# Altium schematic sheet WIFI.SchDoc
size A4
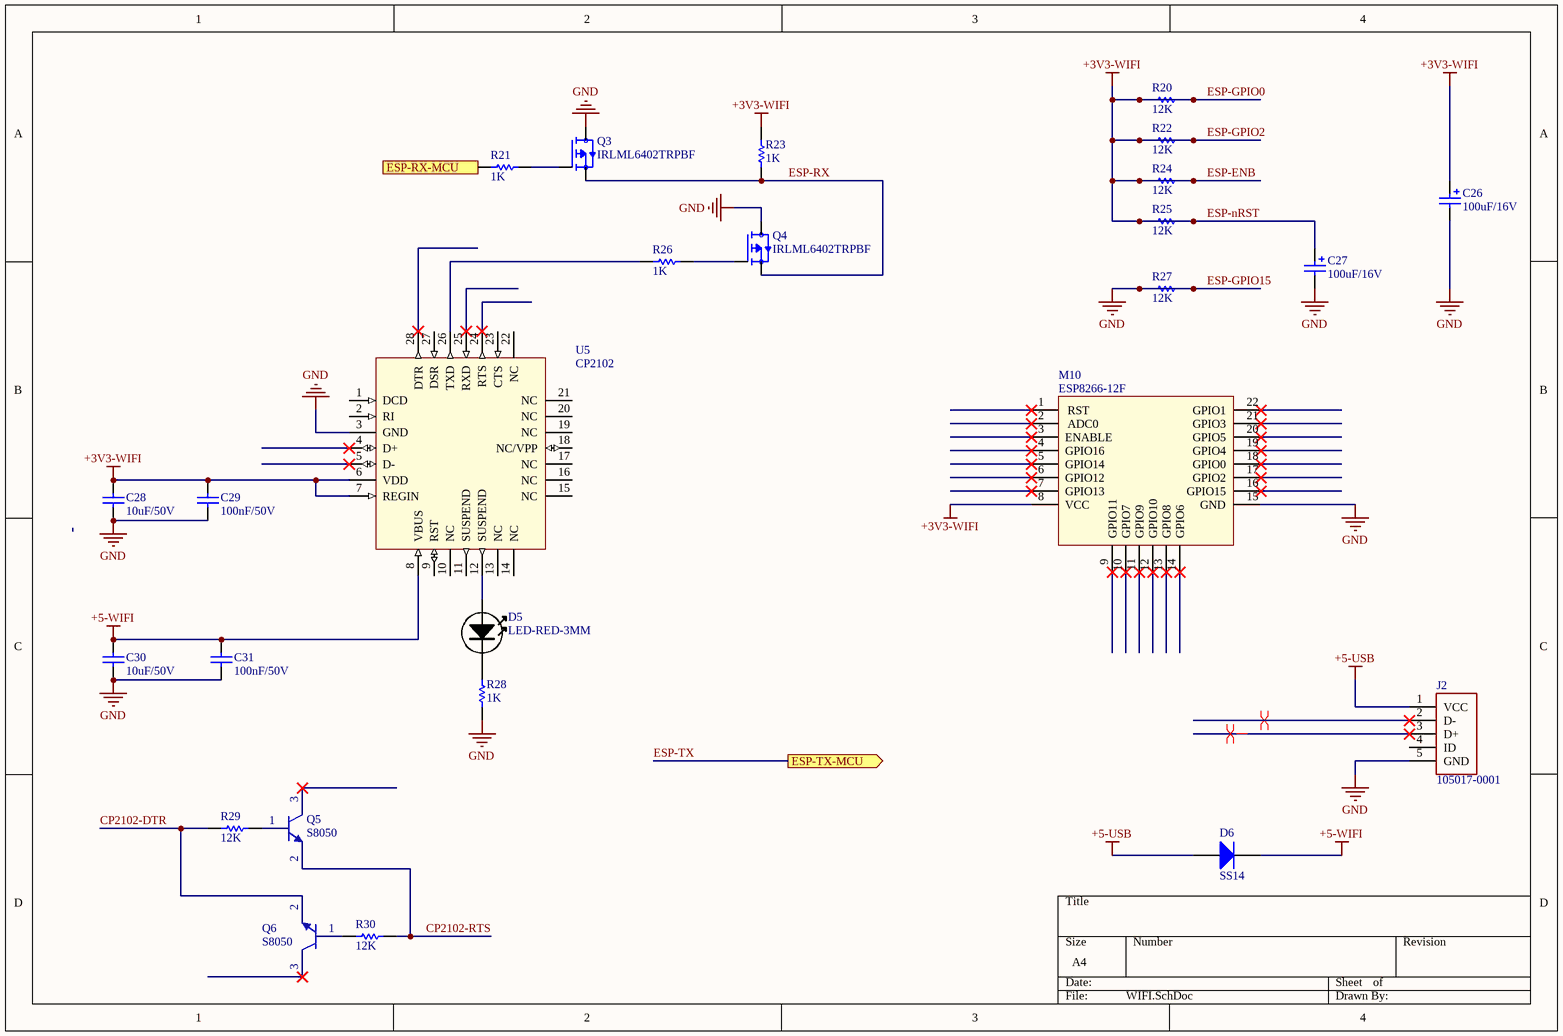
[diagram p0: WIFI.SchDoc]

## Parts
C26  value 100uF/16V  [CAP_SM_TAN]  (hidden comment: TAJB107M006RNJ)
C27  value 100uF/16V  [CAP_SM_TAN]  (hidden comment: TAJB107M006RNJ)
C28  value 10uF/50V  [CAP-SM-0805]  (hidden comment: Cap-10uF-50V-0805)
C29  value 100nF/50V  [CAP-SM-0805]  (hidden comment: Cap-100nF-50V-0805)
C30  value 10uF/50V  [CAP-SM-0805]  (hidden comment: Cap-10uF-50V-0805)
C31  value 100nF/50V  [CAP-SM-0805]  (hidden comment: Cap-100nF-50V-0805)
D5  LED-RED-3MM  [LED-3MM-RED]
D6  SS14  [SS14]
J2  105017-0001  [CONN_105017-0001]
M10  ESP8266-12F
Q3  IRLML6402TRPBF  [SOT95P237X112-3N]
Q4  IRLML6402TRPBF  [SOT95P237X112-3N]
Q5  S8050  [SOT23_NEX]
Q6  S8050  [SOT23_NEX]
R20  value 12K  [RES-SM-0805]  (hidden comment: Res-12K-0805)
R21  value 1K  [RES-SM-0805]  (hidden comment: Res-1K-0805)
R22  value 12K  [RES-SM-0805]  (hidden comment: Res-12K-0805)
R23  value 1K  [RES-SM-0805]  (hidden comment: Res-1K-0805)
R24  value 12K  [RES-SM-0805]  (hidden comment: Res-12K-0805)
R25  value 12K  [RES-SM-0805]  (hidden comment: Res-12K-0805)
R26  value 1K  [RES-SM-0805]  (hidden comment: Res-1K-0805)
R27  value 12K  [RES-SM-0805]  (hidden comment: Res-12K-0805)
R28  value 1K  [RES-SM-0805]  (hidden comment: Res-1K-0805)
R29  value 12K  [RES-SM-0805]  (hidden comment: Res-12K-0805)
R30  value 12K  [RES-SM-0805]  (hidden comment: Res-12K-0805)
U5  CP2102  [CP2102]

## Ports
ESP-RX-MCU (in), ESP-TX-MCU (out)

## Nets
+5-USB: D6.2(A) J2.1(VCC)
+5-WIFI: C30.2 C31.2 D6.1(K) U5.8(VBUS)
ESP-ENB: C26.1 C27.1 C28.2 C29.2 M10.8(VCC) R20.1 R20.2 R22.1 R22.2 R23.2 R24.1 R24.2 R25.1 R25.2 U5.6(VDD) U5.7(REGIN)  [also labelled +3V3-WIFI, ESP-GPIO0, ESP-GPIO2, ESP-nRST]
ESP-GPIO15: C26.2 C27.2 C28.1 C29.1 C30.1 C31.1 J2.5(GND) M10.15(GND) Q3.3(D) Q4.3(D) R27.1 R27.2 R28.1 U5.3(GND)  [also labelled GND]
CP2102-DTR: Q6.2(E) R29.1
CP2102-RTS: Q5.2(E) R30.2
ESP-RX: Q3.2(S) Q4.2(S) R23.1
ESP-RX-MCU: R21.1 ; port ESP-RX-MCU
ESP-TX: port ESP-TX-MCU
NetD5_A: D5.A U5.12(SUSPEND)
NetD5_K: D5.K R28.2
NetQ3_1: Q3.1(G) R21.2
NetQ4_1: Q4.1(G) R26.2
NetQ5_1: Q5.1(B) R29.2
NetQ6_1: Q6.1(B) R30.1
NetR26_1: R26.1 U5.26(TXD)

Not connected (* = marked no-connect by the designer): J2 2(D-)* 3(D+)* 4(ID); M10 1(RST)* 2(ADC0)* 3(ENABLE)* 4(GPIO16)* 5(GPIO14)* 6(GPIO12)* 7(GPIO13)* 9(GPIO11)* 10(GPIO7)* 11(GPIO9)* 12(GPIO10)* 13(GPIO8)* 14(GPIO6)* 16(GPIO15)* 17(GPIO2)* 18(GPIO0)* 19(GPIO4)* 20(GPIO5)* 21(GPIO3)* 22(GPIO1)*; Q5 3(C)*; Q6 3(C)*; U5 1(DCD) 2(RI) 4(D+)* 5(D-)* 9(RST) 10(NC) 11(SUSPEND) 13(NC) 14(NC) 15(NC) 16(NC) 17(NC) 18(NC/VPP) 19(NC) 20(NC) 21(NC) 22(NC) 23(CTS) 24(RTS)* 25(RXD)* 27(DSR) 28(DTR)*

## Layout directives
differential pair: NetJ2_2, NetJ2_3

## Library data of the parts
C26 C27 = Cap-Tan-100uF-16V: Manufacturer: Nichicon; Manufacturer Part Number: UWX1C101MCL1GB; Local Supplier: icdayroi; Local Supplier Link: https://icdayroi.com/tu-tantalum-100uf-16v-smd6032; Supplier 1: Digikey; Supplier 1 Part Number: 493-2105-1-ND; Supplier 1 Link: https://www.digikey.com/product-detail/en/nichicon/UWX1C101MCL1GB/493-2105-1-ND/590080
C28 C30 = Cap-10uF-50V-0805: CAP CER 10UF 50V X5R 0805; Manufacturer: Yageo; Manufacturer Part Number: CC0805KKX5R9BB106; Local Supplier: thegioiic; Local Supplier Link: https://thegioiic.com/products/tu-10uf-50v-0805; Supplier 1: Digikey; Supplier 1 Link: https://www.digikey.com/product-detail/en/yageo/CC0805KKX5R9BB106/311-3499-2-ND/7164383; Supplier 1 Part Number: 311-3499-2-ND
C29 C31 = Cap-100nF-50V-0805: CAP CER 0.1UF 50V Y5V 0805; Manufacturer: Samsung Electro-Mechanics; Manufacturer Part Number: CL21F104ZBCNNNC; Local Supplier: thegioiic; Local Supplier Link: https://thegioiic.com/products/tu-100nf-0-1uf-50v-0805; Supplier 1: Digikey; Supplier 1 Part Number: 1276-1007-1-ND; Supplier 1 Link: https://www.digikey.com/product-detail/en/samsung-electro-mechanics/CL21F104ZBCNNNC/1276-1007-1-ND/3889093
D6 = Diode-SS14: DIODE SCHOTTKY 40V 1A SMA; Manufacturer: ON Semiconductor; Local Supplier: thegioiic; Local Supplier Link: https://thegioiic.com/products/ss14-sma; Supplier 1: Digikey; Supplier 1 Link: https://www.digikey.com/product-detail/en/on-semiconductor/SS14/SS14CT-ND/965729; Manufacturer Part Number: SS14; Supplier 1 Part Number: SS14CT-ND
J2 = 105017-0001: No Description Available; Vendor: Molex Connector Corporation; Built_By: EMA_Cory; SourceLibrary: Molex_2020-05-26; Datasheet: https://www.molex.com/pdm_docs/sd/1050170001_sd.pdf; Manufacturer_Part_Number: 105017-0001; Copyright: Copyright (C) 2018 Accelerated Designs. All rights reserved; RefDes: RefDes; Type: DEV
Q3 Q4 = IRLML6402TRPBF: RoHS Compliant | Industry-leading quality | Fast Switching | Low Profile _less than 1.1mm_ | P-Channel MOSFET | SOT-23 Footprint; MF: Infineon; Package: SOT-23 Infineon; Value: *; Price: None; MP: IRLML6402TRPBF; SnapEDA_Link: https://www.snapeda.com/parts/IRLML6402TRPBF/Infineon%20Technologies/view-part/523558/?ref=snap; Availability: Unavailable
R20 R22 R24 R25 R27 R29 R30 = Res-12K-0805: RES 12 KOHM JUMPER 0805; Manufacturer: Vishay Thin Film; Manufacturer Part Number: PAT0805E3121BST1; Local Supplier: icdayroi; Local Supplier Link: https://icdayroi.com/dien-tro-12k-0805-1-goi-50-con; Supplier 1: Digikey; Supplier 1 Link: https://www.digikey.com/product-detail/en/vishay-thin-film/PAT0805E3121BST1/PAT0805E3121BST1-ND/2281536; Supplier 1 Part Number: PAT0805E3121BST1-ND
R21 R23 R26 R28 = Res-1K-0805: RES 1K OHM 1% 1/4W 0805; Manufacturer: Stackpole Electronics Inc; Manufacturer Part Number: RNCP0805FTD1K00; Local Supplier: thegioiic; Local Supplier Link: https://thegioiic.com/products/dien-tro-1k-ohm-0805-5; Supplier 1: Digikey; Supplier 1 Link: https://www.digikey.com/product-detail/en/stackpole-electronics-inc/RNCP0805FTD1K00/RNCP0805FTD1K00CT-ND/2240568; Supplier 1 Part Number: RNCP0805FTD1K00CT-ND